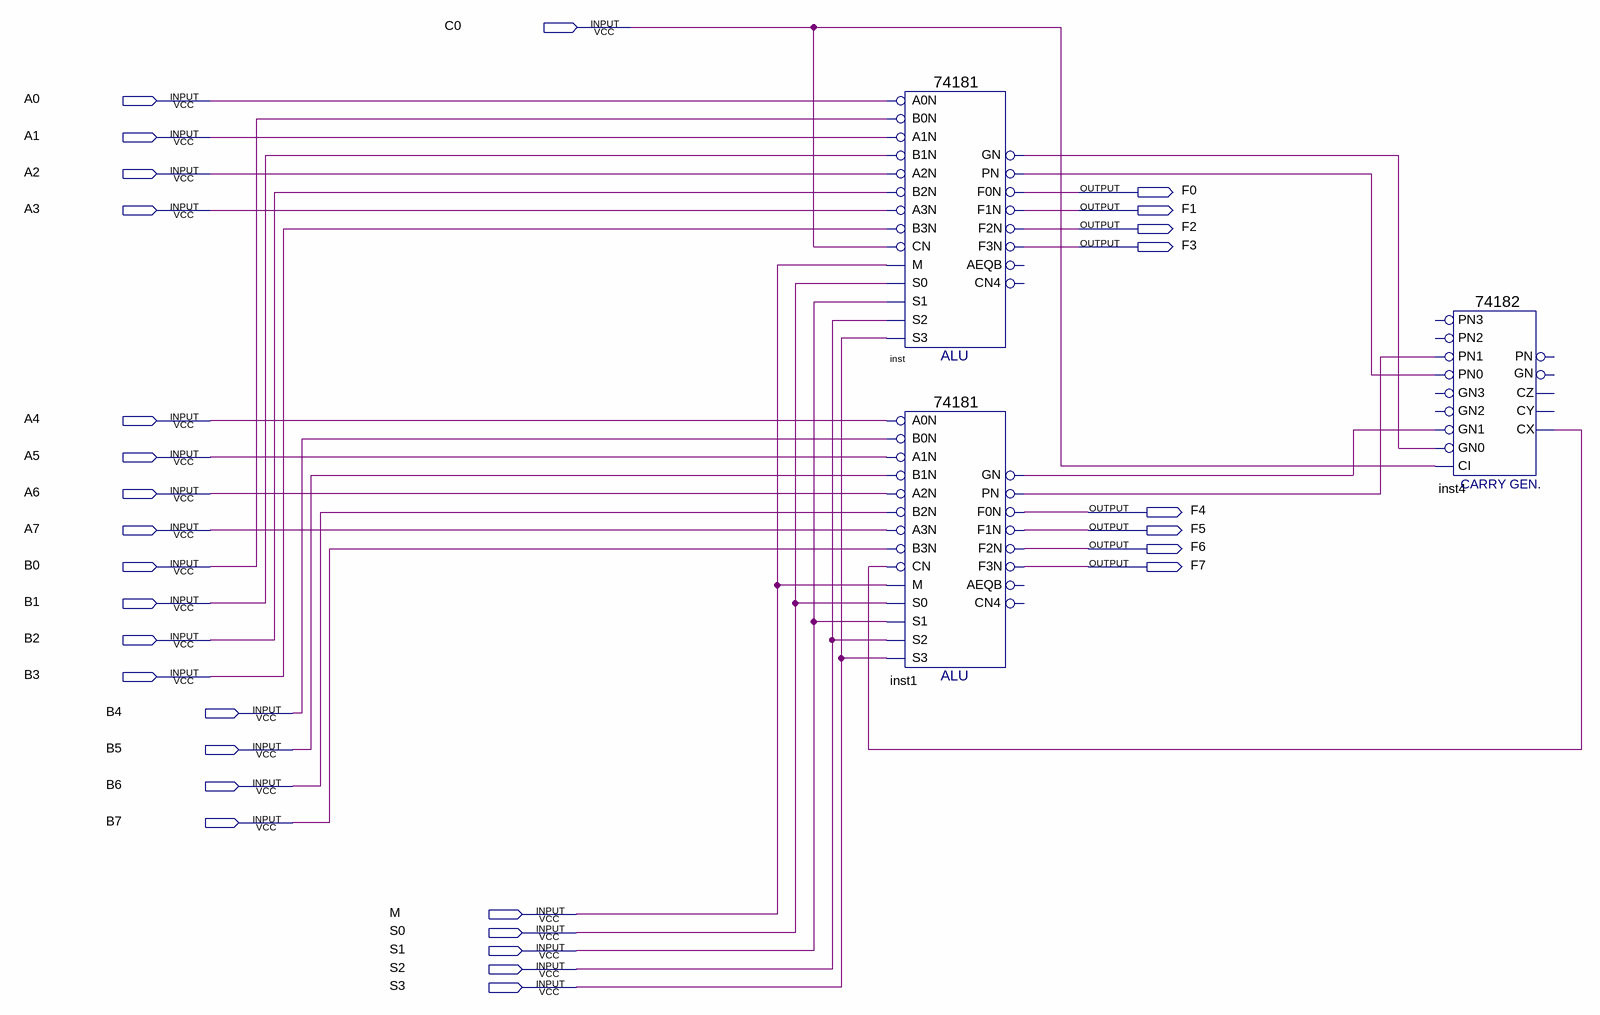
[diagram p0: schematic sheet]
// Quartus schematic ALU.bdf as structural Verilog: 3 symbols, 30 pins
module ALU (
  input  C0,
  input  A0,
  input  A1,
  input  A2,
  input  A3,
  input  A4,
  input  A5,
  input  A6,
  input  A7,
  input  B0,
  input  B1,
  input  B2,
  input  B3,
  input  B4,
  input  B5,
  input  B6,
  input  B7,
  input  M,
  input  S0,
  input  S1,
  input  S2,
  input  S3,
  output F0,
  output F1,
  output F2,
  output F3,
  output F4,
  output F5,
  output F6,
  output F7
);

  wire inst1_gn, inst1_pn, inst4_cx, inst_gn, inst_pn;

  \74181  inst (
    .B0N(B0), .A0N(A0), .A1N(A1), .B1N(B1), .A3N(A3), .B2N(B2), .A2N(A2), .M(M), .CN(C0), .B3N(B3), .S2(S2),
    .S1(S1), .S0(S0), .S3(S3), .PN(inst_pn), .GN(inst_gn), .F3N(F3), .F1N(F1), .F0N(F0), .F2N(F2));  // open: AEQB, CN4
  \74181  inst1 (
    .B0N(B4), .A0N(A4), .A1N(A5), .B1N(B5), .A3N(A7), .B2N(B6), .A2N(A6), .M(M), .CN(inst4_cx), .B3N(B7),
    .S2(S2), .S1(S1), .S0(S0), .S3(S3), .PN(inst1_pn), .GN(inst1_gn), .F3N(F7), .F1N(F5), .F0N(F4), .F2N(F6));  // open: AEQB, CN4
  \74182  inst4 (
    .CI(C0), .PN1(inst1_pn), .PN0(inst_pn), .GN1(inst1_gn), .GN0(inst_gn), .CX(inst4_cx));  // open: PN2, GN2, GN3, PN3, CY, PN, CZ, GN
endmodule
